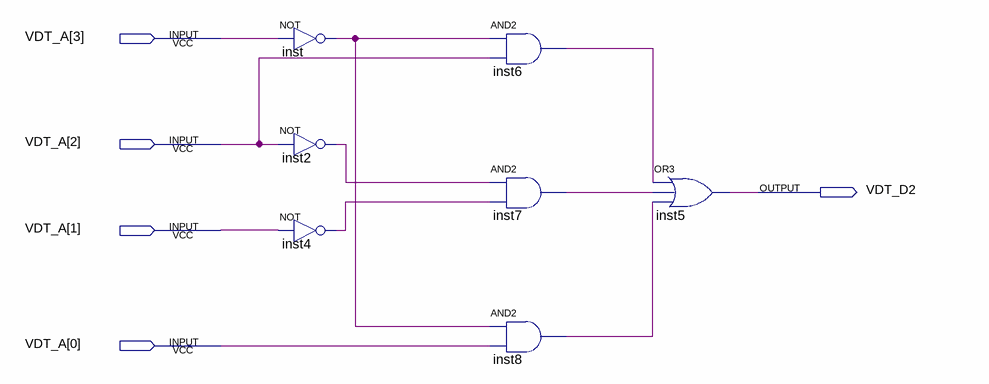
[diagram p0: schematic sheet]
// Quartus schematic D2.bdf as structural Verilog: 7 symbols, 5 pins
module D2 (
  input  [3:0] VDT_A,
  output VDT_D2
);

  wire inst2_out, inst4_out, inst6_out, inst7_out, inst8_out, inst_out;

  not inst (inst_out, VDT_A[3]);
  not inst2 (inst2_out, VDT_A[2]);
  not inst4 (inst4_out, VDT_A[1]);
  and inst6 (inst6_out, inst_out, VDT_A[2]);
  and inst7 (inst7_out, inst2_out, inst4_out);
  and inst8 (inst8_out, inst_out, VDT_A[0]);
  or inst5 (VDT_D2, inst6_out, inst7_out, inst8_out);
endmodule
